# Altium schematic sheet trasmissores e receptores.SchDoc
size A4; SheetNumber: 2; SheetTotal: 5; SPICEModelCacheNZCHGIJP: <root> / <DocumentId>NZCHGIJP</DocumentId> / </root>
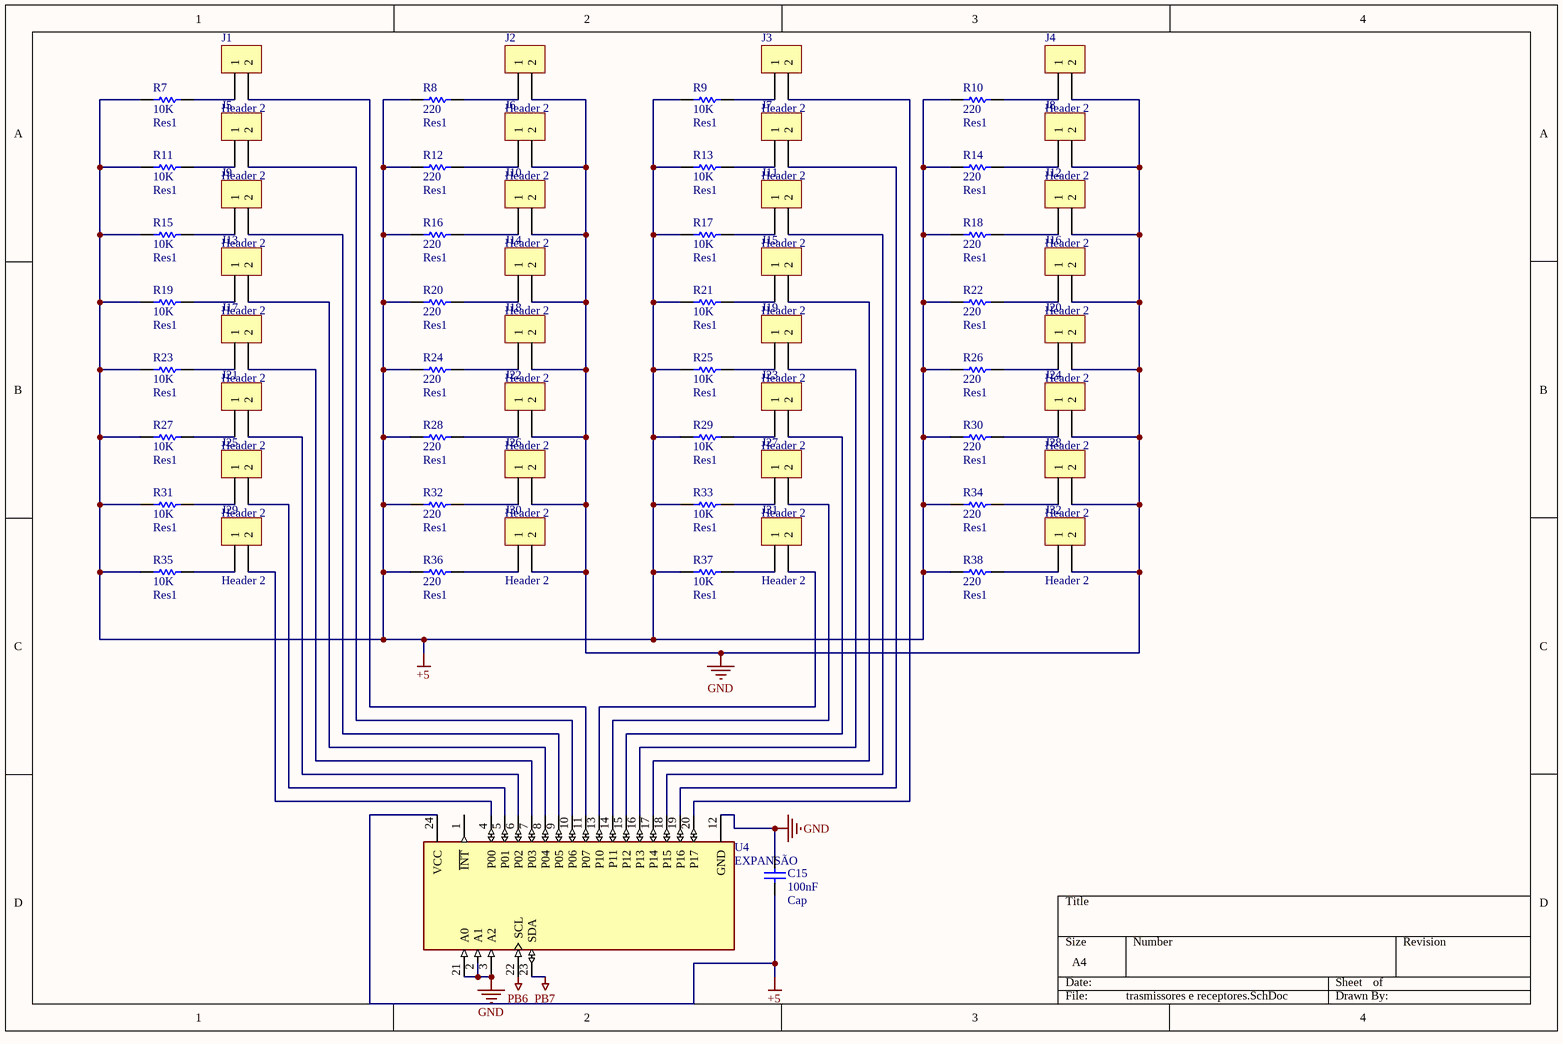
[diagram p0: trasmissores e receptores.SchDoc]

## Parts
C15  Cap  value 100nF  [CAP100N]
J1  Header 2  [Header_KK_2vias]
J2  Header 2  [Header_KK_2vias]
J3  Header 2  [Header_KK_2vias]
J4  Header 2  [Header_KK_2vias]
J5  Header 2  [Header_KK_2vias]
J6  Header 2  [Header_KK_2vias]
J7  Header 2  [Header_KK_2vias]
J8  Header 2  [Header_KK_2vias]
J9  Header 2  [Header_KK_2vias]
J10  Header 2  [Header_KK_2vias]
J11  Header 2  [Header_KK_2vias]
J12  Header 2  [Header_KK_2vias]
J13  Header 2  [Header_KK_2vias]
J14  Header 2  [Header_KK_2vias]
J15  Header 2  [Header_KK_2vias]
J16  Header 2  [Header_KK_2vias]
J17  Header 2  [Header_KK_2vias]
J18  Header 2  [Header_KK_2vias]
J19  Header 2  [Header_KK_2vias]
J20  Header 2  [Header_KK_2vias]
J21  Header 2  [Header_KK_2vias]
J22  Header 2  [Header_KK_2vias]
J23  Header 2  [Header_KK_2vias]
J24  Header 2  [Header_KK_2vias]
J25  Header 2  [Header_KK_2vias]
J26  Header 2  [Header_KK_2vias]
J27  Header 2  [Header_KK_2vias]
J28  Header 2  [Header_KK_2vias]
J29  Header 2  [Header_KK_2vias]
J30  Header 2  [Header_KK_2vias]
J31  Header 2  [Header_KK_2vias]
J32  Header 2  [Header_KK_2vias]
R7  Res1  value 10K  [RES10K]
R8  Res1  value 220  [RES220]
R9  Res1  value 10K  [RES10K]
R10  Res1  value 220  [RES220]
R11  Res1  value 10K  [RES10K]
R12  Res1  value 220  [RES220]
R13  Res1  value 10K  [RES10K]
R14  Res1  value 220  [RES220]
R15  Res1  value 10K  [RES10K]
R16  Res1  value 220  [RES220]
R17  Res1  value 10K  [RES10K]
R18  Res1  value 220  [RES220]
R19  Res1  value 10K  [RES10K]
R20  Res1  value 220  [RES220]
R21  Res1  value 10K  [RES10K]
R22  Res1  value 220  [RES220]
R23  Res1  value 10K  [RES10K]
R24  Res1  value 220  [RES220]
R25  Res1  value 10K  [RES10K]
R26  Res1  value 220  [RES220]
R27  Res1  value 10K  [RES10K]
R28  Res1  value 220  [RES220]
R29  Res1  value 10K  [RES10K]
R30  Res1  value 220  [RES220]
R31  Res1  value 10K  [RES10K]
R32  Res1  value 220  [RES220]
R33  Res1  value 10K  [RES10K]
R34  Res1  value 220  [RES220]
R35  Res1  value 10K  [RES10K]
R36  Res1  value 220  [RES220]
R37  Res1  value 10K  [RES10K]
R38  Res1  value 220  [RES220]
U4  EXPANSÃO  [Modulo]

## Nets
+5: C15.1 R7.1 R8.1 R9.1 R10.1 R11.1 R12.1 R13.1 R14.1 R15.1 R16.1 R17.1 R18.1 R19.1 R20.1 R21.1 R22.1 R23.1 R24.1 R25.1 R26.1 R27.1 R28.1 R29.1 R30.1 R31.1 R32.1 R33.1 R34.1 R35.1 R36.1 R37.1 R38.1 U4.24(VCC)
GND: C15.2 J2.2 J4.2 J6.2 J8.2 J10.2 J12.2 J14.2 J16.2 J18.2 J20.2 J22.2 J24.2 J26.2 J28.2 J30.2 J32.2 U4.2(A1) U4.3(A2) U4.12(GND) U4.21(A0)
PB6: U4.22(SCL)
PB7: U4.23(SDA)
NetJ1_1: J1.1 R7.2
NetJ1_2: J1.2 U4.11(P07)
NetJ2_1: J2.1 R8.2
NetJ3_1: J3.1 R9.2
NetJ3_2: J3.2 U4.20(P17)
NetJ4_1: J4.1 R10.2
NetJ5_1: J5.1 R11.2
NetJ5_2: J5.2 U4.10(P06)
NetJ6_1: J6.1 R12.2
NetJ7_1: J7.1 R13.2
NetJ7_2: J7.2 U4.19(P16)
NetJ8_1: J8.1 R14.2
NetJ9_1: J9.1 R15.2
NetJ9_2: J9.2 U4.9(P05)
NetJ10_1: J10.1 R16.2
NetJ11_1: J11.1 R17.2
NetJ11_2: J11.2 U4.18(P15)
NetJ12_1: J12.1 R18.2
NetJ13_1: J13.1 R19.2
NetJ13_2: J13.2 U4.8(P04)
NetJ14_1: J14.1 R20.2
NetJ15_1: J15.1 R21.2
NetJ15_2: J15.2 U4.17(P14)
NetJ16_1: J16.1 R22.2
NetJ17_1: J17.1 R23.2
NetJ17_2: J17.2 U4.7(P03)
NetJ18_1: J18.1 R24.2
NetJ19_1: J19.1 R25.2
NetJ19_2: J19.2 U4.16(P13)
NetJ20_1: J20.1 R26.2
NetJ21_1: J21.1 R27.2
NetJ21_2: J21.2 U4.6(P02)
NetJ22_1: J22.1 R28.2
NetJ23_1: J23.1 R29.2
NetJ23_2: J23.2 U4.15(P12)
NetJ24_1: J24.1 R30.2
NetJ25_1: J25.1 R31.2
NetJ25_2: J25.2 U4.5(P01)
NetJ26_1: J26.1 R32.2
NetJ27_1: J27.1 R33.2
NetJ27_2: J27.2 U4.14(P11)
NetJ28_1: J28.1 R34.2
NetJ29_1: J29.1 R35.2
NetJ29_2: J29.2 U4.4(P00)
NetJ30_1: J30.1 R36.2
NetJ31_1: J31.1 R37.2
NetJ31_2: J31.2 U4.13(P10)
NetJ32_1: J32.1 R38.2

Not connected (* = marked no-connect by the designer): U4 1(~{INT})

## Library data of the parts
C15 = Cap: Capacitor; Published: 8-Jun-2000; LatestRevisionDate: 17-Jul-2002; LatestRevisionNote: Re-released for DXP Platform.; PackageReference: RAD-0.3; Publisher: Altium Limited; PackageDescription: Radial Cap, Thru-Hole; 2 Leads; 0.3 in Pin Spacing
J1-J32 = Header 2: Conn KK 2 vias; LatestRevisionDate: 17-Jul-2002; LatestRevisionNote: Re-released for DXP Platform.; Publisher: Altium Limited
R7-R38 = Res1: Resistor; Published: 8-Jun-2000; LatestRevisionDate: 17-Jul-2002; LatestRevisionNote: Re-released for DXP Platform.; PackageReference: AXIAL-0.3; Publisher: Altium Limited; PackageDescription: Axial Device, Thru-Hole; 2 Leads; 0.3 in Pin Spacing
U4 = EXPANSÃO: 16-bit 2.5- to 5.5-V I2C/SMBus I/O expander with interrupt; MF: Texas Instruments; MP: PCF8575DW; SnapEDA_Link: https://www.snapeda.com/parts/PCF8575DW/Texas+Instruments/view-part/?ref=snap; Package: SOIC-24 Texas Instruments; Value: *; Check_prices: https://www.snapeda.com/parts/PCF8575DW/Texas+Instruments/view-part/?ref=eda